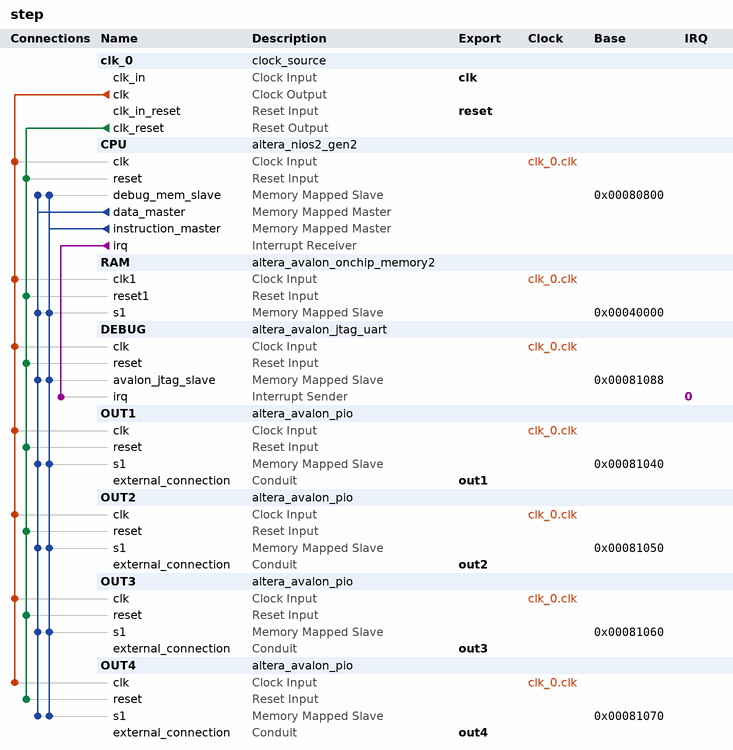
[diagram p0: system contents]
# Platform Designer (Qsys) system step, Cyclone IV E EP4CE115F29C7
# Parameters at their usual value, and those the tool derives, are not listed.
package require -exact qsys 17.1
create_system step
set_project_property DEVICE_FAMILY {Cyclone IV E}
set_project_property DEVICE EP4CE115F29C7

add_instance clk_0 clock_source 17.1
set_instance_parameter_value clk_0 clockFrequency 50000000

add_instance CPU altera_nios2_gen2 17.1
set_instance_parameter_value CPU dcache_size 2048
set_instance_parameter_value CPU exceptionSlave RAM.s1
set_instance_parameter_value CPU icache_size 4096
set_instance_parameter_value CPU impl Tiny
set_instance_parameter_value CPU resetSlave RAM.s1

add_instance RAM altera_avalon_onchip_memory2 17.1
set_instance_parameter_value RAM dataWidth 32
set_instance_parameter_value RAM dualPort false
set_instance_parameter_value RAM initMemContent true
set_instance_parameter_value RAM initializationFileName onchip_mem.hex
set_instance_parameter_value RAM memorySize 204800

add_instance DEBUG altera_avalon_jtag_uart 17.1
set_instance_parameter_value DEBUG simInteractiveOptions NO_INTERACTIVE_WINDOWS

add_instance OUT1 altera_avalon_pio 17.1
set_instance_parameter_value OUT1 direction Output
set_instance_parameter_value OUT1 width 1

add_instance OUT2 altera_avalon_pio 17.1
set_instance_parameter_value OUT2 direction Output
set_instance_parameter_value OUT2 width 1

add_instance OUT3 altera_avalon_pio 17.1
set_instance_parameter_value OUT3 direction Output
set_instance_parameter_value OUT3 width 1

add_instance OUT4 altera_avalon_pio 17.1
set_instance_parameter_value OUT4 direction Output
set_instance_parameter_value OUT4 width 1

# connections
add_connection clk_0.clk CPU.clk clock
add_connection clk_0.clk DEBUG.clk clock
add_connection clk_0.clk OUT1.clk clock
add_connection clk_0.clk OUT2.clk clock
add_connection clk_0.clk OUT3.clk clock
add_connection clk_0.clk OUT4.clk clock
add_connection clk_0.clk RAM.clk1 clock
add_connection clk_0.clk_reset CPU.reset reset
add_connection clk_0.clk_reset DEBUG.reset reset
add_connection clk_0.clk_reset OUT1.reset reset
add_connection clk_0.clk_reset OUT2.reset reset
add_connection clk_0.clk_reset OUT3.reset reset
add_connection clk_0.clk_reset OUT4.reset reset
add_connection clk_0.clk_reset RAM.reset1 reset
add_connection CPU.data_master CPU.debug_mem_slave avalon
set_connection_parameter_value CPU.data_master/CPU.debug_mem_slave baseAddress 0x00080800
add_connection CPU.data_master DEBUG.avalon_jtag_slave avalon
set_connection_parameter_value CPU.data_master/DEBUG.avalon_jtag_slave baseAddress 0x00081088
add_connection CPU.data_master OUT1.s1 avalon
set_connection_parameter_value CPU.data_master/OUT1.s1 baseAddress 0x00081040
add_connection CPU.data_master OUT2.s1 avalon
set_connection_parameter_value CPU.data_master/OUT2.s1 baseAddress 0x00081050
add_connection CPU.data_master OUT3.s1 avalon
set_connection_parameter_value CPU.data_master/OUT3.s1 baseAddress 0x00081060
add_connection CPU.data_master OUT4.s1 avalon
set_connection_parameter_value CPU.data_master/OUT4.s1 baseAddress 0x00081070
add_connection CPU.data_master RAM.s1 avalon
set_connection_parameter_value CPU.data_master/RAM.s1 baseAddress 0x00040000
add_connection CPU.instruction_master CPU.debug_mem_slave avalon
set_connection_parameter_value CPU.instruction_master/CPU.debug_mem_slave baseAddress 0x00080800
add_connection CPU.instruction_master DEBUG.avalon_jtag_slave avalon
set_connection_parameter_value CPU.instruction_master/DEBUG.avalon_jtag_slave baseAddress 0x00081088
add_connection CPU.instruction_master OUT1.s1 avalon
set_connection_parameter_value CPU.instruction_master/OUT1.s1 baseAddress 0x00081040
add_connection CPU.instruction_master OUT2.s1 avalon
set_connection_parameter_value CPU.instruction_master/OUT2.s1 baseAddress 0x00081050
add_connection CPU.instruction_master OUT3.s1 avalon
set_connection_parameter_value CPU.instruction_master/OUT3.s1 baseAddress 0x00081060
add_connection CPU.instruction_master OUT4.s1 avalon
set_connection_parameter_value CPU.instruction_master/OUT4.s1 baseAddress 0x00081070
add_connection CPU.instruction_master RAM.s1 avalon
set_connection_parameter_value CPU.instruction_master/RAM.s1 baseAddress 0x00040000
add_connection CPU.irq DEBUG.irq interrupt
set_connection_parameter_value CPU.irq/DEBUG.irq irqNumber 0

# exported interfaces
add_interface clk clock sink
set_interface_property clk EXPORT_OF clk_0.clk_in
add_interface out1 conduit end
set_interface_property out1 EXPORT_OF OUT1.external_connection
add_interface out2 conduit end
set_interface_property out2 EXPORT_OF OUT2.external_connection
add_interface out3 conduit end
set_interface_property out3 EXPORT_OF OUT3.external_connection
add_interface out4 conduit end
set_interface_property out4 EXPORT_OF OUT4.external_connection
add_interface reset reset sink
set_interface_property reset EXPORT_OF clk_0.clk_in_reset

set_interconnect_requirement {$system} qsys_mm.clockCrossingAdapter HANDSHAKE
set_interconnect_requirement {$system} qsys_mm.enableEccProtection FALSE
set_interconnect_requirement {$system} qsys_mm.insertDefaultSlave FALSE
set_interconnect_requirement {$system} qsys_mm.maxAdditionalLatency 1

save_system step.qsys
